# EAGLE design 454_stereo_mic_Rev020003 (EAGLE 9.6.2)
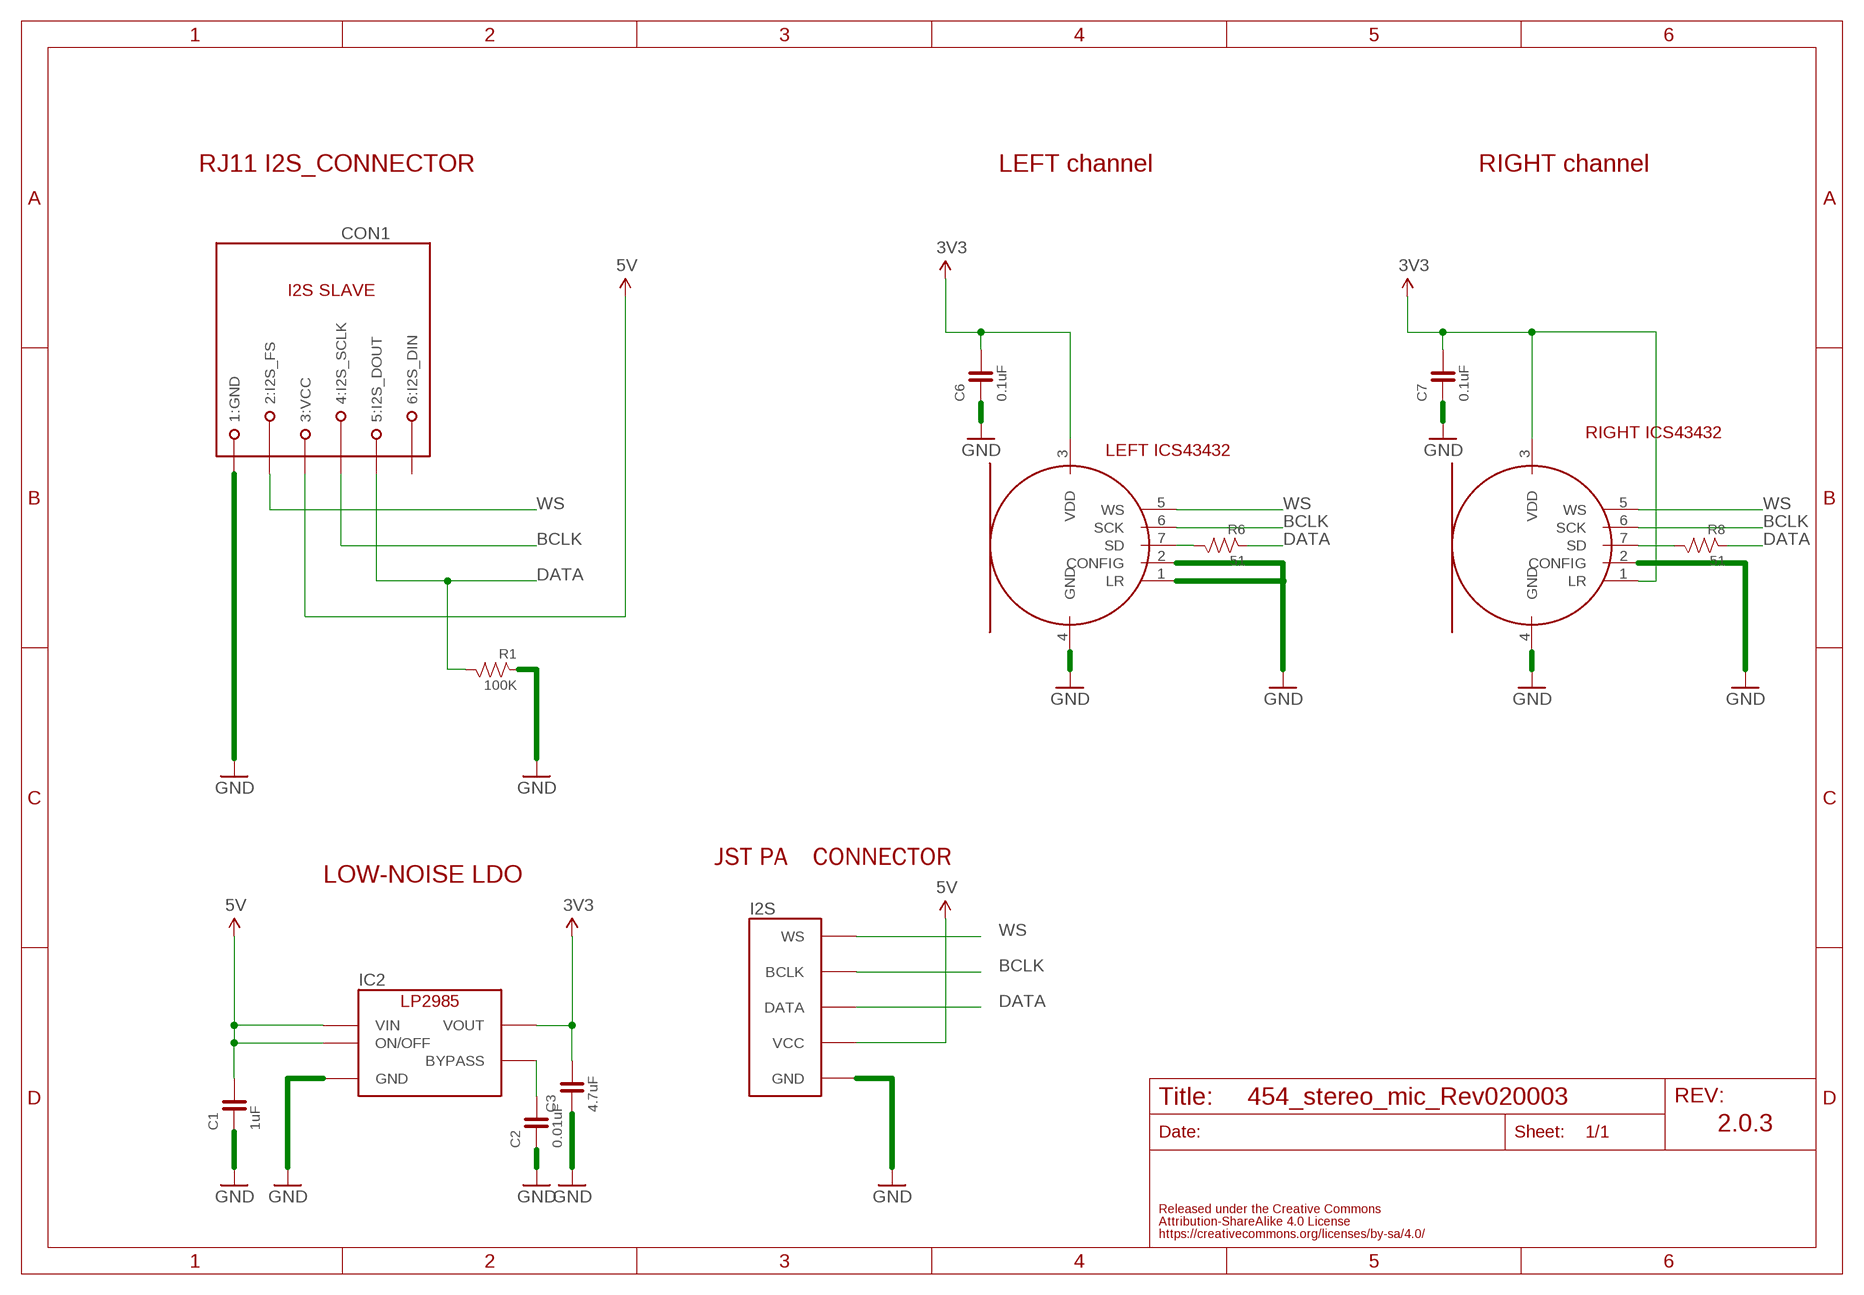
[diagram p0: schematic, sheet 1]

## Parts
C1  1uF  CAPACITOR-0603  [0603]
C2  0.01uF  CAPACITOR-0603  [0603]
C3  4.7uF  CAPACITOR-0603  [0603]
C6  0.1uF  CAPACITOR-0603  [0603]
C7  0.1uF  CAPACITOR-0603  [0603]
CON1  MODULAR-JACK-6P-RJ11_I2S_SLAVE  [7002-6PXC-X]
I2S  FABO_BRICK_I2STOP  [FABO_BRICK_I2S_B05B-PARK-1]
IC2  LP2985-33DBV  [SOT-23-5]
MIC_LEFT  TDK-ICS43432  [TDK-ICS43432]
MIC_RIGHT  TDK-ICS43432  [TDK-ICS43432]
R1  100K  RESISTOR-0603  [0603]
R6  51  RESISTOR-0603  [0603]
R8  51  RESISTOR-0603  [0603]

## Nets
3V3: C3.2 C6.2 C7.2 IC2.5(VOUT) MIC_LEFT.3(VDD) MIC_RIGHT.1(LR) MIC_RIGHT.3(VDD)
5V: C1.2 CON1.3(3:VCC) I2S.VCC IC2.1(VIN) IC2.3(ON/OFF)
BCLK: CON1.4(4:I2S_SCLK) I2S.BCLK MIC_LEFT.6(SCK) MIC_RIGHT.6(SCK)
DATA: CON1.5(5:I2S_DOUT) I2S.DATA R1.2 R6.1 R8.1
GND: C1.1 C2.1 C3.1 C6.1 C7.1 CON1.1(1:GND) I2S.GND IC2.2(GND) MIC_LEFT.1(LR) MIC_LEFT.2(CONFIG) MIC_LEFT.4(GND) MIC_RIGHT.2(CONFIG) MIC_RIGHT.4(GND) R1.1
N$1: C2.2 IC2.4(BYPASS)
N$4: MIC_LEFT.7(SD) R6.2
N$5: MIC_RIGHT.7(SD) R8.2
WS: CON1.2(2:I2S_FS) I2S.WS MIC_LEFT.5(WS) MIC_RIGHT.5(WS)
Unconnected: CON1.6(6:I2S_DIN)

## Notes on the sheet
- RJ11 I2S_CONNECTOR | LEFT channel | RIGHT channel
- RIGHT ICS43432
- LEFT ICS43432
- JST PA　CONNECTOR
- LOW-NOISE LDO
- 2.0.3

## Library data of the parts
C1-C3 C6 C7 = FaBo-Capacitor:CAPACITOR: CAPACITOR
CON1 = FaBo-Connetor:MODULAR-JACK-6P-RJ11_I2S_SLAVE
I2S = FaBo-Template:FABO_BRICK_I2S
IC2 = FaBo-Supply:LP2985: LP2985
MIC_LEFT MIC_RIGHT = FaBo-Mems:TDK-ICS43432
R1 R6 R8 = FaBo-Resistors:RESISTOR: RESISTOR

## Board
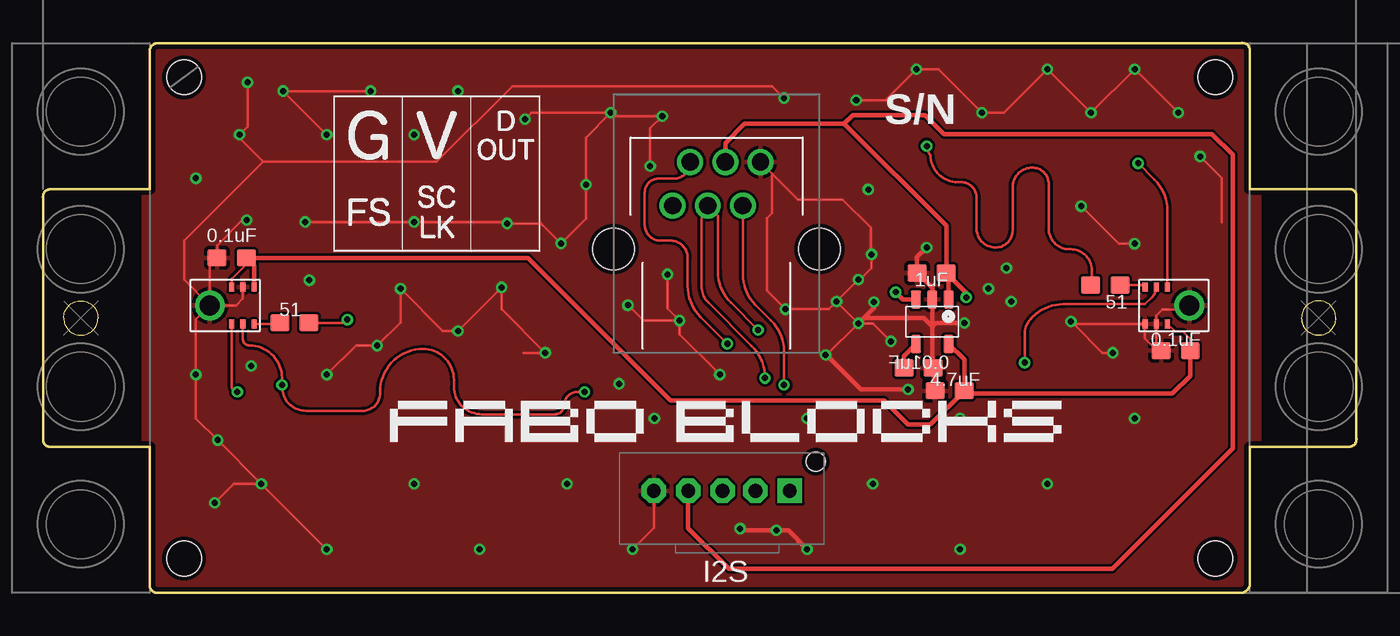
[diagram p1: board, top side]
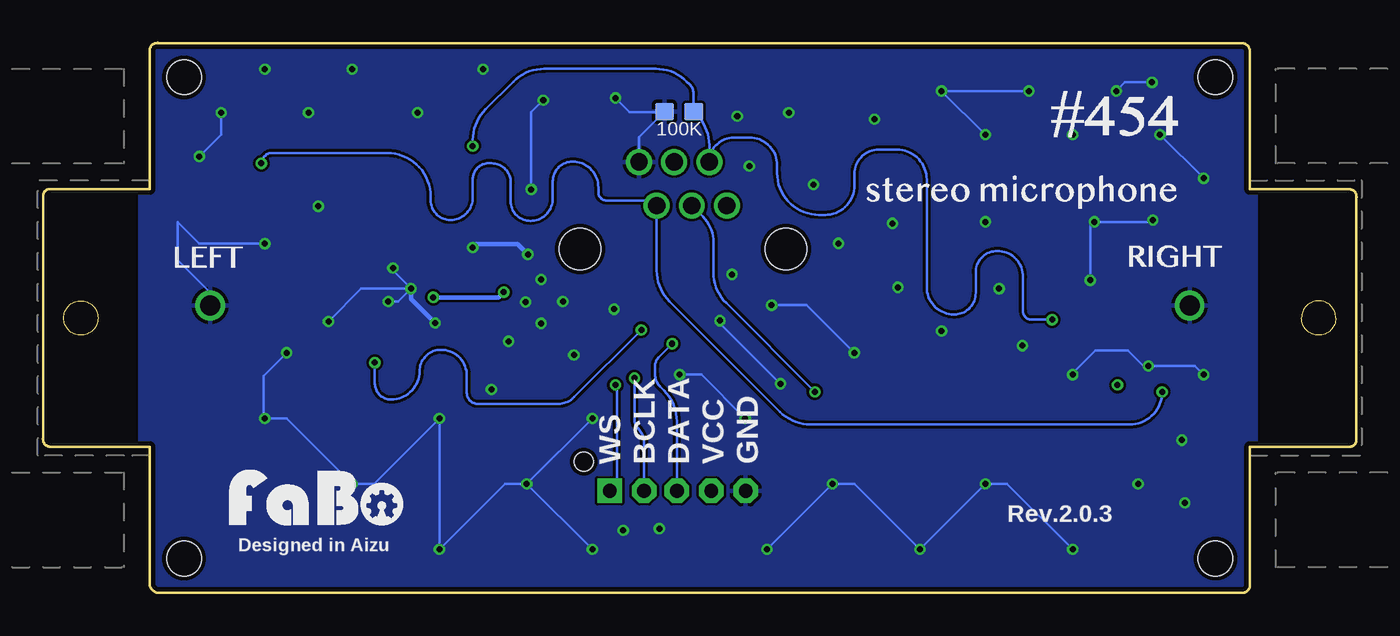
[diagram p2: board, bottom side, seen from below]

Size 76.41 x 32.01 mm. Coordinates in mm from the lower left corner, seen from the top.
Outline: 6.7,32 69.7,32 arc-90 70.2,31.6 70.2,23.5 76,23.5 arc-90 76.4,23.1 76.4,9 arc-90 76,8.5 70.2,8.5 70.2,0.5 arc-90 69.6,0 6.7,0 arc-90 6.2,0.4 6.2,8.5 0.4,8.5 arc-90 0,8.9 0,23 arc-90 0.4,23.5 6.2,23.5 6.2,31.5 arc-90 6.7,32
Outline: 1.2,16 arc-180 3.2,16 arc-180 1.2,16
Outline: 73.2,16 arc180 75.2,16 arc180 73.2,16
Copper layers (1*16): Top 0.035mm / dielectric 1.6mm / Bottom 0.035mm
Design rules "PCBway": minimum track width 6mil, minimum drill 12mil, track to track 6mil, track to pad 6mil, pad to pad 6mil, via to via 6mil, smd to smd 6mil, copper to edge 10mil, drill to drill 10mil, minimum pad ring 10mil, minimum via ring 6mil, stop-mask expansion 2mil, vias tented up to drill 100mil, thermal gap 8mil
Holes 2 mm at 8.2,30 8.2,2 68.2,30 68.2,2
tRestrict: area -2.9,6.1 to 5.7,25.8; area 70.9,6.9 to 79.5,26.6
bRestrict: area 70.9,6.5 to 79.5,26.2; area -2.9,5.7 to 5.7,25.4

### Footprints (pad centres in the part's own frame; a part is rotated, then mirrored left to right if it is on the bottom)
0603 = smd 1.1 x 1: 1 -0.85,0; 2 0.85,0
7002-6PXC-X = drill 1: 1 2.55,5.08; 2 1.53,2.54; 3 0.51,5.08; 4 -0.51,2.54; 5 -1.53,5.08; 6 -2.55,2.54 | hole 2.4: -6,0; 6,0
FABO_BRICK_I2S_B05B-PARK-1 = drill 0.8 pad 1.422 octagon: BCLK 1.635,2.54; DATA -0.27,2.54; GND -4.27,2.54; VCC -2.27,2.54 | drill 0.8 pad 1.422 square: WS 3.635,2.54 | hole 1.1: 5.135,4.24
SOT-23-5 = smd 0.6 x 1.05: 1 -0.95,-1.3; 2 0,-1.3; 3 0.95,-1.3; 4 0.95,1.3; 5 -0.95,1.3
TDK-ICS43432 = smd 0.5 x 0.3: 1 1.075,-2.575; 2 1.075,-1.925; 3 1.075,-1.275; 5 -1.075,-1.275; 6 -1.075,-1.925; 7 -1.075,-2.575 | drill 1.15 pad 1.65: 4 0,0

### Placement (x,y rotation side)
C1  51.69,18.62 0 top
C2  50.94,13.09 180 top
C3  52.74,11.77 0 top
C6  10.98,19.5 0 top
C7  65.89,14.1 0 top
CON1  39.18,20 0 top
I2S  39.8,3.4 0 top
IC2  51.73,15.78 180 top
MIC_LEFT  66.68,16.73 270 top
MIC_RIGHT  9.7,16.73 90 top
R1  39.4,28 0 bottom
R6  61.8,17.92 0 top
R8  14.63,15.72 180 top
U$2  [4-1BLOCK]  2.2,16 0 top
U$3  [4-1BLOCK]  74.2,16 180 top
U$4  [LOGO_FABO_M]  60.51,3.56 0 bottom

### Tracks (layer width: path | path; a pad name or v marks a point on that pad's centre or on a via)
3V3
  Top 0.152: MIC_LEFT.3 65.85,15.2 66.3,15.2 66.74,14.77 C7.2 | 12.28,19.05 11.87,19.46 | 11.87,19.46 C6.2 | MIC_RIGHT.3 10.98,18.28 11.87,19.17 11.87,19.46
  Top 0.254: C7.2 66.74,12.64 65.7,11.6 53.79,11.6 53.59,11.8 | MIC_RIGHT.1 12.28,19.05 C6.2 28.2,19.5 36.5,11.2 48.9,11.2 50.3,9.8 51.62,9.8 C3.2 53.59,11.8 | 53.59,11.8 53.59,13.57 IC2.5
5V  (via drill 0.35)
  Top 0.152: 52.54,18.5 C1.2
  Top 0.254: CON1.3 39.69,26.19 40.8,27.3 46.6,27.3 | 52.54,18.8 52.54,21.37 46.6,27.3 | 52.54,18.8 52.54,18.5 | I2S.VCC 37.53,3.77 39.9,1.4 62.2,1.4 69.2,8.4 69.2,25.5 68,26.7 52.4,26.7 51.3,27.8 47.1,27.8 46.6,27.3 | IC2.1 52.68,18.66 52.54,18.8 | C1.2 53.7,17.46 v53.7,17.2 | v49.6,17.5 50.02,17.08 IC2.3
  Bottom 0.254: v53.7,17.2 49.9,17.2 v49.6,17.5
BCLK  (via drill 0.35)
  Top 0.152: MIC_LEFT.6 arc-45 64.51,17.21 64.1,16.8 59.35,16.8 arc45 57.56,16.06 57.5,16 arc45 57.1,15.04 v57.1,13.4 | MIC_RIGHT.6 11.63,14.78 arc90 12,14.4 arc-90 13.9,12.5 v13.9,12.1 13.9,12 arc90 15.3,10.6 18.6,10.6 arc90 19.6,11.6 19.6,11.7 arc-90 22.1,14.2 arc-90 23.9,12.4 23.9,12 arc90 25.5,10.4 29.8,10.4 arc90 30.3,10.9 arc-90 31.1,11.7 v31.5,11.7 | v42,12.5 arc45 41.22,14.38 38.71,16.9 arc-45 38.3,17.87 38.3,21.66 arc-45 CON1.4 39.27,21.94 39.27,18.69 arc45 40.01,16.89 v41.6,15.3
  Bottom 0.152: CON1.4 38.02,21.9 arc45 37.4,20.4 37.4,18.65 arc-45 36.66,16.86 v31.5,11.7 | v57.1,13.4 57.1,12.2 arc-90 56.15,11.25 arc-90 54.5,12.9 arc90 53.25,14.15 arc90 51.75,12.65 51.75,11.65 arc-90 51.1,11 46.45,11 arc-45 45.51,11.39 v41.6,15.3 | I2S.BCLK 41.44,8.72 arc-45 41.8,9.6 arc45 42,10.09 v42,12.5
DATA  (via drill 0.35)
  Top 0.152: v51.4,26 arc45 51.61,25.49 arc90 53.2,23.9 53.4,23.9 arc-90 54.3,23 54.3,21.2 arc90 55.4,20.1 arc90 56.4,21.1 56.4,23.6 arc-90 57.55,24.75 arc-90 58.5,23.8 58.5,21.2 arc90 59.7,20 59.8,20 arc-90 61,18.8 61,18.02 arc-90 60.9,17.92 R6.1 | R8.1 17.52,15.72 arc90 v17.7,15.9 | CON1.5 arc-90 36.67,24.1 35.8,24.1 arc90 35,23.3 35,21.4 arc90 35.9,20.5 36.5,20.5 arc-90 37.5,19.5 37.5,17.85 arc45 38.25,16.06 v39.8,14.5
  Bottom 0.152: v51.4,26 51.4,26.35 arc45 50.66,28.15 49.05,29.76 arc45 47.25,30.5 40.75,30.5 arc45 38.96,29.76 38.8,29.6 arc45 38.55,29 R1.2 38.39,27.84 arc45 37.65,26.05 CON1.5 arc90 36.23,26.5 35.3,26.5 arc90 33.7,24.9 33.7,24.44 arc-90 31.26,22 30.9,22 arc-90 29.2,23.7 29.2,24.4 arc90 27.8,25.8 26.74,25.8 arc90 25,24.06 25,17.8 arc-90 23.4,16.2 arc-90 22.15,17.45 22.15,18.65 arc90 20.9,19.9 arc90 19.4,18.4 19.4,16.4 arc-90 18.9,15.9 v17.7,15.9 | v39.8,14.5 40.59,13.71 arc-45 40.8,13.2 40.8,12.73 arc-45 40.5,12 40.28,11.78 arc45 39.53,9.98 I2S.DATA
GND  (via drill 0.35)
  Top 0.152: MIC_RIGHT.4 9.7,19.08 C6.1 10.13,20.23 11.59,21.69 v11.84,21.69 | MIC_RIGHT.2 11.63,17.13 11.23,16.73 MIC_RIGHT.4 | MIC_LEFT.4 66.45,16.5 65.1,16.5 64.75,16.15 MIC_LEFT.2 64.75,14.38 C7.1 64.81,14.1 64.1,14.8 MIC_LEFT.1 59.95,15.65 | 42.4,24.41 43.91,22.9 46.5,22.9 48.15,21.25 48.15,19.75 v48.2,19.7 48.2,18.9 47.53,18.23 v47.43,18.23 v46.16,16.96 | 59.95,15.65 v59.8,15.8 | MIC_RIGHT.4 8.2,18.23 8.2,20.5 12.8,25.1 | v43.1,28.8 42.4,29.5 27.3,29.5 22.9,25.1 12.8,25.1 | 12.8,25.1 11.43,26.47 v11.43,26.67 11.89,27.13 v11.89,29.71 | v19.05,29.21 v13.97,29.21 v16.51,26.67 | v9.99,5.24 11.1,6.35 v12.7,6.35 | v12.7,6.35 v16.51,2.54 | v12.7,6.35 v10.16,8.89 8.89,10.16 v8.89,12.7 8.89,15.92 MIC_RIGHT.4 | v16.51,12.7 18.2,14.39 v19.44,14.39 20.79,15.74 v20.79,17.7 23.25,15.24 v24.13,15.24 v26.67,17.78 26.67,16.51 v29.21,13.97 27.94,13.97 | v15.24,21.59 v21.59,21.59 26.9,21.59 v26.99,21.5 28.97,21.5 v30.13,20.34 31.58,21.79 v31.58,23.76 31.58,26.5 v33.02,27.94 | v28.04,27.57 28.41,27.94 v33.02,27.94 | v39.37,12.7 37.02,15.05 v37.02,15.84 | v37.02,15.84 34.92,15.84 v34.02,16.74 | v62.23,13.97 61.63,13.97 59.95,15.65 | v47.3,28.68 49,28.68 v50.8,30.48 52.07,30.48 v54.61,27.94 55.88,27.94 v58.42,30.48 v60.96,27.94 v63.5,30.48 v66.04,27.94 | v67.31,25.4 68.58,24.13 68.58,21.59 | v60.39,22.5 62.57,20.32 v63.5,20.32 | v37.02,15.84 36.32,16.54 v36.32,18.54 | v46.16,16.96 45.71,16.51 v43.18,16.51 42.1,17.59 42.1,21.8 42.4,22.1 42.4,24.41 | v46.16,16.96 v47.43,15.69 | v47.43,15.69 45.58,13.84 v45.52,13.84 | v47.43,15.69 48.27,15.69 v49.32,14.64 | v35.32,24.84 35.32,27.04 v36.02,27.74 33.22,27.74 v33.02,27.94
  Top 0.152: I2S.GND 35.53,3.78 v34.29,2.54 | 42.4,24.41 CON1.1
  Top 0.254: 51.73,15.5 IC2.2 51.73,17.73 C1.1 | 51.73,15.5 51.73,13.15 C2.1 51.89,12.99 C3.1 | 51.73,15.5 51.23,16 47.74,16 v47.43,15.69 48.33,16.59 v48.33,16.93 | C1.1 50.84,19.54 v51.4,20.1 | C1.1 50.45,18.23 | 51.73,15.5 51.93,15.7 v53.6,15.7 | v50.32,11.84 47.58,11.84 45.58,13.84 | v40.55,3.74 40.65,3.64 v42.65,3.64 43.35,3.64 v44.45,2.54
  Bottom 0.152: CON1.1 41.73,26.53 40.28,27.98 | 40.28,27.98 R1.1 | v59.8,15.8 57.9,17.7 v55,17.7 | v43.1,28.8 42.28,27.98 40.28,27.98 | v11.43,26.67 v8.89,24.13 | v11.89,29.71 13.47,29.71 v13.97,29.21 | v19.05,29.21 v24.13,29.21 v21.59,26.67 | v8.89,12.7 9.39,13.2 v12.11,13.2 12.4,13.2 13.3,14.1 15.2,14.1 16.51,12.79 v16.51,12.7 | v15.49,18.2 15.49,21.34 v15.24,21.59 11.94,21.59 v11.84,21.69 | v29.21,13.97 31.98,16.74 v34.02,16.74 | v16.51,2.54 20.32,6.35 v21.59,6.35 v25.4,2.54 29.21,6.35 v30.48,6.35 v34.29,2.54 | v35.56,10.16 38.1,12.7 v39.37,12.7 | v33.51,12.17 37.02,15.68 v37.02,15.84 | v44.45,2.54 v48.26,6.35 | v48.26,6.35 v44.45,10.16 | v48.26,6.35 49.53,6.35 v53.34,2.54 v53.34,10.16 57.15,6.35 v58.42,6.35 62.23,10.16 v63.5,10.16 63.58,10.08 63.58,12.62 v62.23,13.97 | v56.05,18.9 56.05,18.75 v55,17.7 | v56.32,16.96 55.74,16.96 v55,17.7 | v48,23.48 48,27.98 v47.3,28.68 | v63.5,20.32 67.31,20.32 68.58,21.59 68.58,19.38 66.68,17.48 MIC_LEFT.4 | v67.31,25.4 66.04,26.67 v66.04,27.94
  Bottom 0.254: v51.4,20.1 51.2,20.3 48.8,20.3 v48.2,19.7 | v53.6,15.7 55,17.1 v55,17.7
  pour Top (rank 6): -3.57,-1.95 78.18,-1.95 78.18,36.63 -3.57,36.63
  pour Bottom (rank 6): -5.12,-3.25 79.81,-3.25 79.81,35.33 -5.12,35.33
N$1
  Top 0.254: C2.2 50.09,13.79 IC2.4
N$4
  Top 0.152: R6.2 63.82,17.92 arc-45 MIC_LEFT.7
N$5
  Top 0.152: R8.2 13.71,15.65 MIC_RIGHT.7
WS  (via drill 0.35)
  Top 0.152: v63.7,25 64.66,24.05 arc-45 65.4,22.25 MIC_LEFT.5 | v11.3,11.7 arc-90 10.98,12.03 MIC_RIGHT.5 | v43.1,12.1 43.1,14.05 arc45 42.36,15.85 41.45,16.75 arc-45 40.71,18.55 CON1.2
  Bottom 0.152: v63.7,25 63.64,25.07 arc90 63.1,25.6 56.39,25.6 arc90 53.85,23.06 53.85,22.85 arc-90 52.7,21.7 arc-90 51.4,23 51.4,24.1 arc90 50.5,25 50.3,25 arc90 49.2,23.9 49.2,22.8 arc-90 48.05,21.65 arc-90 46.75,22.95 46.75,23.95 arc90 45.6,25.1 arc90 44.1,23.6 44.1,23.3 arc-90 43.64,22.84 41.01,22.84 CON1.2 40.71,18.76 arc-45 39.96,16.96 33.55,10.55 arc-45 31.75,9.8 13.2,9.8 arc-90 v11.3,11.7 | I2S.WS 43,6.38 43,12 v43.1,12.1

### Text on the board
tPlace: S/N
bPlace: GND | VCC | DATA | BCLK | WS | Rev.2.0.3 | Designed in Aizu
Document: #454 Stereo Microphone / Rev2.0.3 / 2024/04/16